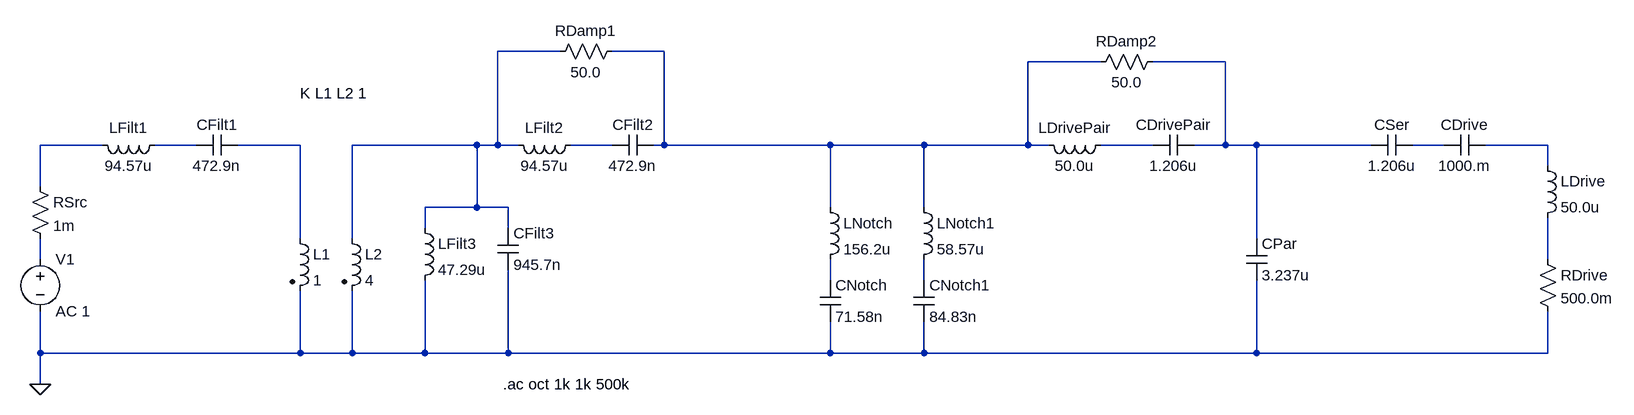
[diagram p0: schematic SmallFilterDemo.asc]
SmallFilterDemo.asc, the LTspice schematic file:
Version 4
SHEET 1 1984 680
WIRE 352 -80 256 -80
WIRE 512 -80 432 -80
WIRE 1184 -64 1072 -64
WIRE 1376 -64 1264 -64
WIRE -352 64 -448 64
WIRE -208 64 -272 64
WIRE -48 64 -144 64
WIRE 224 64 32 64
WIRE 256 64 256 -80
WIRE 256 64 224 64
WIRE 288 64 256 64
WIRE 432 64 368 64
WIRE 512 64 512 -80
WIRE 512 64 496 64
WIRE 768 64 512 64
WIRE 912 64 768 64
WIRE 1072 64 1072 -64
WIRE 1072 64 912 64
WIRE 1104 64 1072 64
WIRE 1264 64 1184 64
WIRE 1376 64 1376 -64
WIRE 1376 64 1328 64
WIRE 1424 64 1376 64
WIRE 1600 64 1424 64
WIRE 1712 64 1664 64
WIRE 1872 64 1776 64
WIRE 1872 96 1872 64
WIRE -448 128 -448 64
WIRE 224 160 224 64
WIRE 224 160 144 160
WIRE 272 160 224 160
WIRE 768 160 768 64
WIRE 912 160 912 64
WIRE 144 192 144 160
WIRE 272 192 272 160
WIRE -48 208 -48 64
WIRE 32 208 32 64
WIRE 1424 208 1424 64
WIRE -448 240 -448 208
WIRE 1872 240 1872 176
WIRE 768 272 768 240
WIRE 912 272 912 240
WIRE -448 384 -448 320
WIRE -48 384 -48 288
WIRE -48 384 -448 384
WIRE 32 384 32 288
WIRE 32 384 -48 384
WIRE 144 384 144 272
WIRE 144 384 32 384
WIRE 272 384 272 256
WIRE 272 384 144 384
WIRE 768 384 768 336
WIRE 768 384 272 384
WIRE 912 384 912 336
WIRE 912 384 768 384
WIRE 1424 384 1424 272
WIRE 1424 384 912 384
WIRE 1872 384 1872 320
WIRE 1872 384 1424 384
WIRE -448 432 -448 384
FLAG -448 432 0
SYMBOL voltage -448 224 R0
WINDOW 123 0 0 Left 0
WINDOW 39 0 0 Left 0
SYMATTR InstName V1
SYMATTR Value AC 1
SYMBOL ind -256 48 R90
WINDOW 0 5 56 VBottom 2
WINDOW 3 32 56 VTop 2
SYMATTR InstName LFilt1
SYMATTR Value 94.57u
SYMATTR SpiceLine Rser=104.0m
SYMBOL cap -144 48 R90
WINDOW 0 0 32 VBottom 2
WINDOW 3 32 32 VTop 2
SYMATTR InstName CFilt1
SYMATTR Value 472.9n
SYMBOL res -464 112 R0
SYMATTR InstName RSrc
SYMATTR Value 1m
SYMBOL ind 384 48 R90
WINDOW 0 5 56 VBottom 2
WINDOW 3 32 56 VTop 2
SYMATTR InstName LFilt2
SYMATTR Value 94.57u
SYMATTR SpiceLine Rser=104.0m
SYMBOL cap 496 48 R90
WINDOW 0 0 32 VBottom 2
WINDOW 3 32 32 VTop 2
SYMATTR InstName CFilt2
SYMATTR Value 472.9n
SYMBOL ind 128 176 R0
SYMATTR InstName LFilt3
SYMATTR Value 47.29u
SYMATTR SpiceLine Rser=65.35m
SYMBOL cap 256 192 R0
SYMATTR InstName CFilt3
SYMATTR Value 945.7n
SYMBOL ind 752 144 R0
SYMATTR InstName LNotch
SYMATTR Value 156.2u
SYMATTR SpiceLine Rser=145.6m
SYMBOL cap 752 272 R0
SYMATTR InstName CNotch
SYMATTR Value 71.58n
SYMBOL cap 1408 208 R0
SYMATTR InstName CPar
SYMATTR Value 3.237u
SYMBOL cap 1664 48 R90
WINDOW 0 0 32 VBottom 2
WINDOW 3 32 32 VTop 2
SYMATTR InstName CSer
SYMATTR Value 1.206u
SYMBOL cap 1776 48 R90
WINDOW 0 0 32 VBottom 2
WINDOW 3 32 32 VTop 2
SYMATTR InstName CDrive
SYMATTR Value 1000.m
SYMBOL ind 1856 80 R0
SYMATTR InstName LDrive
SYMATTR Value 50.0u
SYMBOL res 1856 224 R0
SYMATTR InstName RDrive
SYMATTR Value 500.0m
SYMBOL res 448 -96 R90
WINDOW 0 0 56 VBottom 2
WINDOW 3 32 56 VTop 2
SYMATTR InstName RDamp1
SYMATTR Value 50.0
SYMBOL ind 1200 48 R90
WINDOW 0 5 56 VBottom 2
WINDOW 3 32 56 VTop 2
SYMATTR InstName LDrivePair
SYMATTR Value 50.0u
SYMATTR SpiceLine Rser=104.0m
SYMBOL cap 1328 48 R90
WINDOW 0 0 32 VBottom 2
WINDOW 3 32 32 VTop 2
SYMATTR InstName CDrivePair
SYMATTR Value 1.206u
SYMBOL res 1280 -80 R90
WINDOW 0 0 56 VBottom 2
WINDOW 3 32 56 VTop 2
SYMATTR InstName RDamp2
SYMATTR Value 50.0
SYMBOL ind 896 144 R0
SYMATTR InstName LNotch1
SYMATTR Value 58.57u
SYMATTR SpiceLine Rser=75.44m
SYMBOL cap 896 272 R0
SYMATTR InstName CNotch1
SYMATTR Value 84.83n
SYMBOL ind2 -64 192 R0
SYMATTR InstName L1
SYMATTR Value 1
SYMATTR Type ind
SYMBOL ind2 16 192 R0
SYMATTR InstName L2
SYMATTR Value 4
SYMATTR Type ind
TEXT 264 432 Left 2 !.ac oct 1k 1k 500k
TEXT -48 -16 Left 2 !K L1 L2 1

The netlist it stands for:
* SmallFilterDemo.asc
V1 N011 0 AC 1
LFilt1 N005 N004 94.57u Rser=104.0m
CFilt1 N006 N005 472.9n
RSrc N004 N011 1m
LFilt2 N007 N001 94.57u Rser=104.0m
CFilt2 N002 N007 472.9n
LFilt3 N001 0 47.29u Rser=65.35m
CFilt3 N001 0 945.7n
LNotch N002 N013 156.2u Rser=145.6m
CNotch N013 0 71.58n
CPar N003 0 3.237u
CSer N009 N003 1.206u
CDrive N010 N009 1000.m
LDrive N010 N012 50.0u
RDrive N012 0 500.0m
RDamp1 N002 N001 50.0
LDrivePair N008 N002 50.0u Rser=104.0m
CDrivePair N003 N008 1.206u
RDamp2 N003 N002 50.0
LNotch1 N002 N014 58.57u Rser=75.44m
CNotch1 N014 0 84.83n
L1 N006 0 1
L2 N001 0 4
.ac oct 1k 1k 500k
K L1 L2 1
.backanno
.end